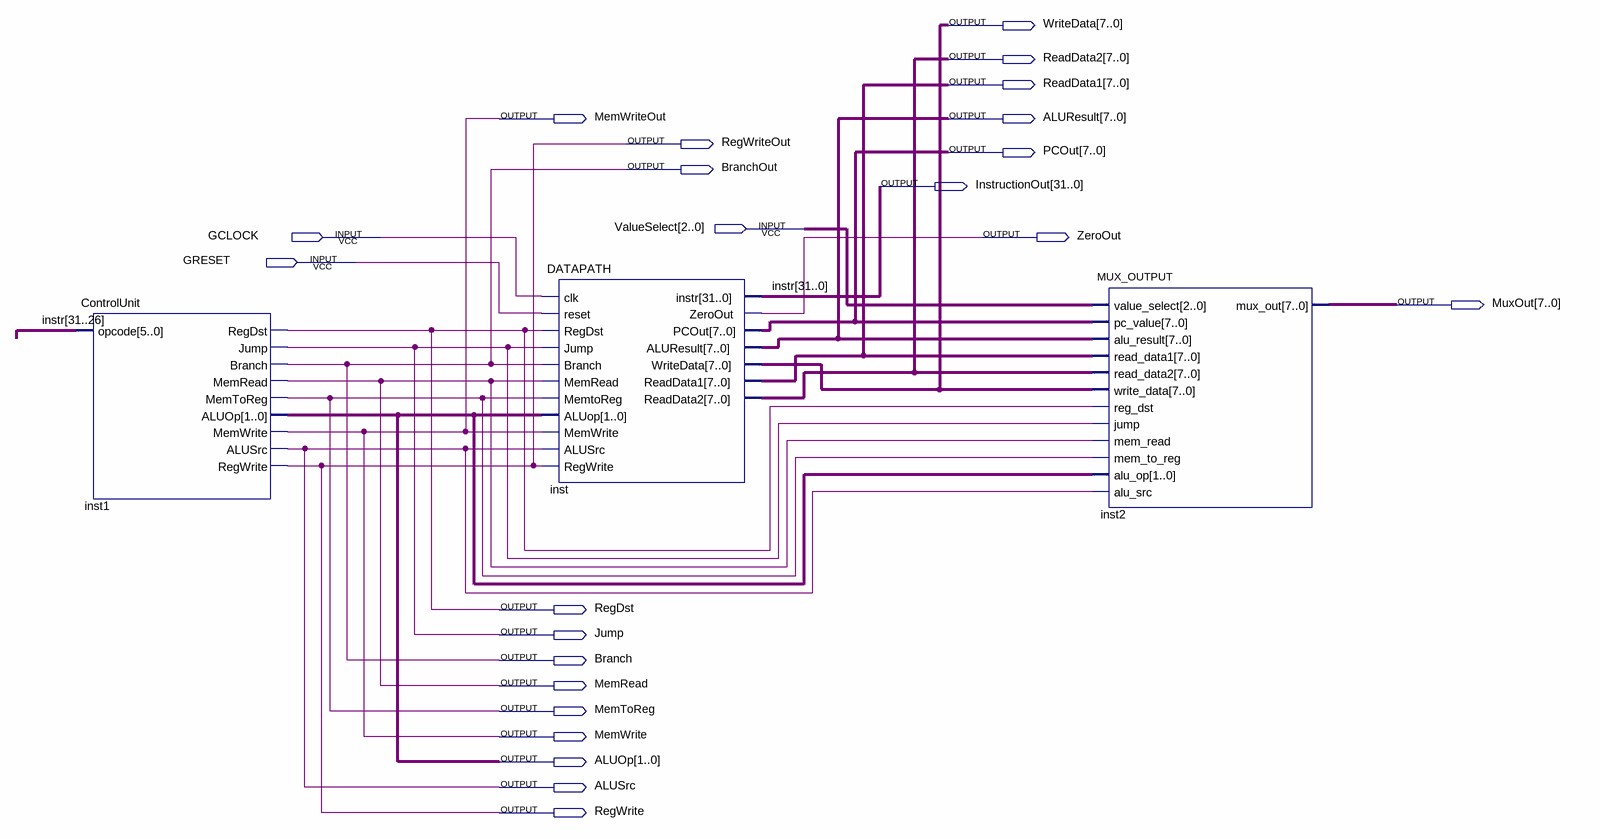
[diagram p0: schematic sheet]
// Quartus schematic SignleCycleProcessor.bdf as structural Verilog: 3 symbols, 23 pins
module SignleCycleProcessor (
  input  [2:0] ValueSelect,
  input  GCLOCK,
  input  GRESET,
  output [7:0] WriteData,
  output [7:0] ReadData2,
  output [7:0] ReadData1,
  output MemWriteOut,
  output [7:0] ALUResult,
  output RegWriteOut,
  output [7:0] PCOut,
  output BranchOut,
  output [31:0] InstructionOut,
  output ZeroOut,
  output [7:0] MuxOut,
  output RegDst,
  output Jump,
  output Branch,
  output MemRead,
  output MemToReg,
  output MemWrite,
  output [1:0] ALUOp,
  output ALUSrc,
  output RegWrite
);

  ControlUnit inst1 (
    .opcode(InstructionOut[31:26]), .RegDst(RegDst), .Jump(Jump), .Branch(Branch), .MemRead(MemRead),
    .MemToReg(MemToReg), .ALUOp(ALUOp), .MemWrite(MemWrite), .ALUSrc(ALUSrc), .RegWrite(RegWrite));
  DATAPATH inst (
    .clk(GCLOCK), .reset(GRESET), .RegDst(RegDst), .Jump(Jump), .Branch(Branch), .MemRead(MemRead),
    .MemtoReg(MemToReg), .ALUop(ALUOp), .MemWrite(MemWrite), .ALUSrc(ALUSrc), .RegWrite(RegWrite),
    .instr(InstructionOut), .ZeroOut(ZeroOut), .PCOut(PCOut), .ALUResult(ALUResult), .WriteData(WriteData),
    .ReadData1(ReadData1), .ReadData2(ReadData2));
  MUX_OUTPUT inst2 (
    .value_select(ValueSelect), .pc_value(PCOut), .alu_result(ALUResult), .read_data1(ReadData1),
    .read_data2(ReadData2), .write_data(WriteData), .reg_dst(RegDst), .jump(Jump), .mem_read(MemRead),
    .mem_to_reg(MemToReg), .alu_op(ALUOp), .alu_src(ALUSrc), .mux_out(MuxOut));

  assign BranchOut = Branch;
  assign MemWriteOut = MemWrite;
  assign RegWriteOut = RegWrite;

  // Other names for the same wires on the sheet: instr[31:0] = InstructionOut
endmodule
